# Altium schematic sheet HHO.SCHDOC
size B
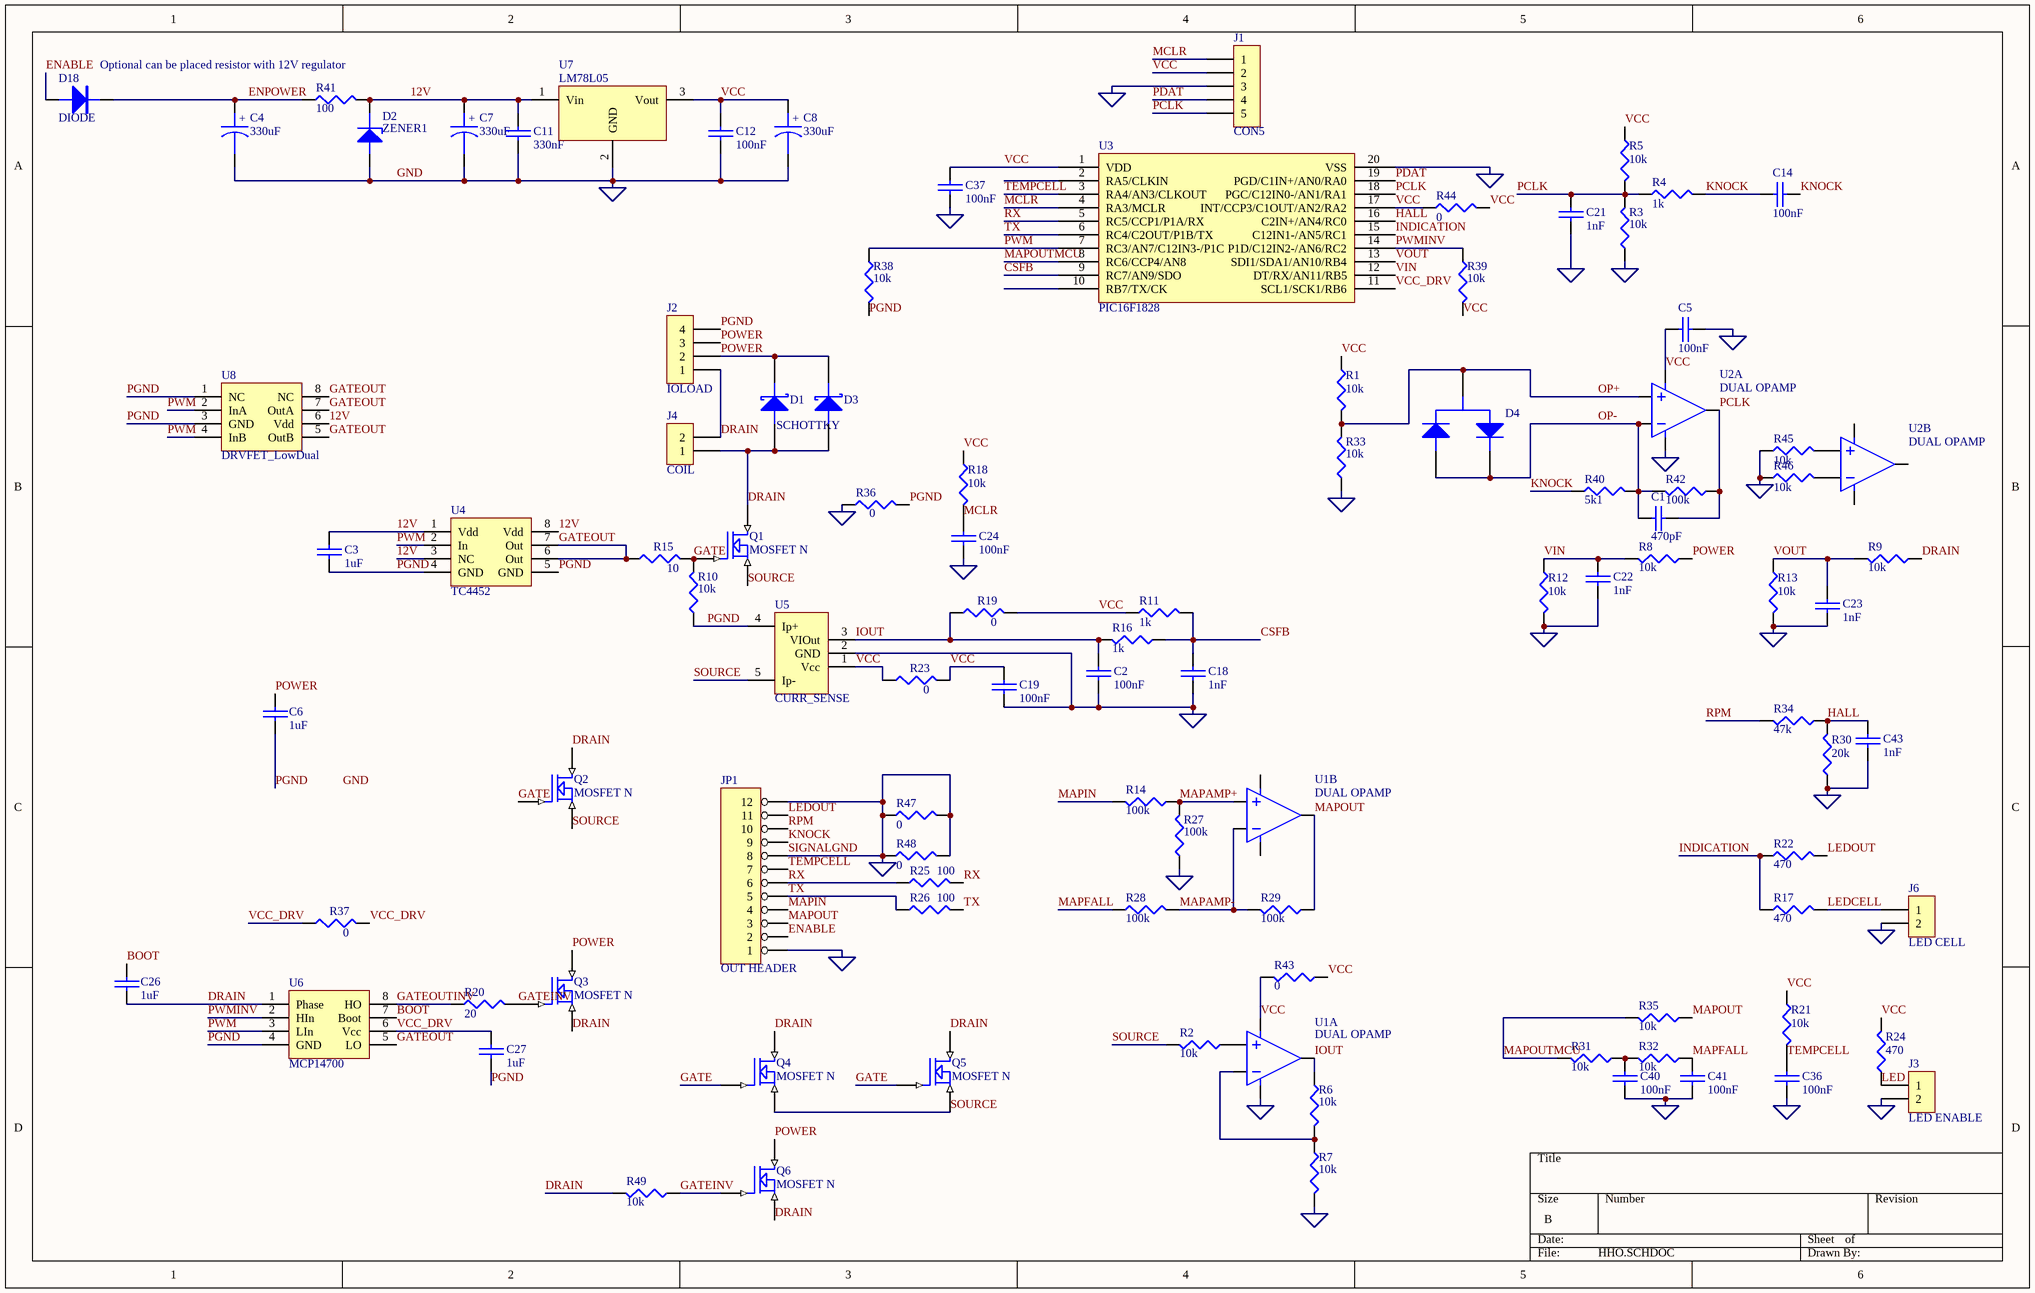
[diagram p0: HHO.SCHDOC]

## Parts
C1  470pF  [0603 CAP]
C2  100nF  [0603 CAP]
C3  1uF  [0805]
C4  330uF  [RA 6.3MM]
C5  100nF  [0603 CAP]
C6  1uF  [1210]
C7  330uF  [3528 + RA 6.3mm NOT ROUND]
C8  330uF  [3528 + RA 6.3mm NOT ROUND]
C11  330nF  [0805]
C12  100nF  [0805]
C14  100nF  [0603 CAP]
C18  1nF  [0603 CAP]
C19  100nF  [0603 CAP]
C21  1nF  [0603 CAP]
C22  1nF  [0603 CAP]
C23  1nF  [0603 CAP]
C24  100nF  [0603 CAP]
C26  1uF  [0805]
C27  1uF  [1005]
C36  100nF  [0603 CAP]
C37  100nF  [0603 CAP]
C40  100nF  [0603 CAP]
C41  100nF  [0603 CAP]
C43  1nF  [0603 CAP]
D1  SCHOTTKY  [D2-Pack - 3 - DIODE]
D2  ZENER1  [SIP2]
D3  (no value)  [D2-Pack - 3 - DIODE]
D4  DUAL DIODE BAV99  [SOT-23]  (value not drawn)
D18  DIODE  [SIP2]
J1  CON5  [SIP5]
J2  IOLOAD  [HD 11mm 4P HAMMOND]
J3  LED ENABLE  [SIP2]
J4  COIL  [SIP2 - INDUCTOR 20A]
J6  LED CELL  [SIP2]
JP1  OUT HEADER  [PWD12R]
Q1  MOSFET N  [D2-Pack - 7]
Q2  MOSFET N  [D2-Pack - 7]
Q3  MOSFET N  [D2-Pack - 7]
Q4  MOSFET N  [TO220]
Q5  MOSFET N  [TO220]
Q6  MOSFET N  [TO220]
R1  10k  [1005]
R2  10k  [0603 RES]
R3  10k  [0603 RES]
R4  1k  [0603 RES]
R5  10k  [0603 RES]
R6  10k  [0603 RES]
R7  10k  [0603 RES]
R8  10k  [0603 RES]
R9  10k  [1005]
R10  10k  [0603 RES]
R11  1k  [0603 RES]
R12  10k  [0603 RES]
R13  10k  [0603]
R14  100k  [0603 RES]
R15  10  [0603 RES]
R16  1k  [0603 RES]
R17  470  [0603 RES]
R18  10k  [0603 RES]
R19  0  [0603 RES]
R20  20  [0603 RES]
R21  10k  [0603 RES]
R22  470  [0603 RES]
R23  0  [0603 RES]
R24  470  [0603 RES]
R25  100  [0603 RES]
R26  100  [0603 RES]
R27  100k  [0603 RES]
R28  100k  [0603 RES]
R29  100k  [0603 RES]
R30  20k  [0603 RES]
R31  10k  [0603 RES]
R32  10k  [0603 RES]
R33  10k  [0603 RES]
R34  47k  [0603 RES]
R35  10k  [0603 RES]
R36  0  [0805]
R37  0  [0603 RES]
R38  10k  [0603 RES]
R39  10k  [0603 RES]
R40  5k1  [0603 RES]
R41  100  [0805]
R42  100k  [0603 RES]
R43  0  [0603 RES]
R44  0  [0603 RES]
R45  10k  [0603 RES]
R46  10k  [0603 RES]
R47  0  [0603 RES]
R48  0  [0603 RES]
R49  10k  [0603 RES]
U1  DUAL OPAMP  [SO-8]  (parts A,B of 2)
U2  DUAL OPAMP  [SO-8]  (parts A,B of 2)
U3  PIC16F1828  [SOIC20WIDE]
U4  TC4452  [SO-8]
U5  CURR_SENSE  [5-CB WIDE]
U6  MCP14700  [SO-8]
U7  LM78L05  [TO-92 WIDE]
U8  DRVFET_LowDual  [SO-8]

## Nets
GND: C2.2 C4.2 C5.1 C7.2 C8.2 C11.2 C12.2 C18.2 C19.2 C21.2 C22.2 C23.2 C24.2 C36.2 C37.2 C40.2 C41.2 C43.2 D2.1(A) J1.3 J3.2 J6.2 JP1.1 JP1.8 JP1.12 R3.1 R7.2 R12.2 R13.2 R27.1 R30.1 R33.1 R36.1 R45.1 R46.1 R47.1 R47.2 R48.1 R48.2 U1.4(V-) U2.4(V-) U3.20(VSS) U5.2(GND) U7.2(GND)  [also labelled SGND, SIGNALGND]
12V: C3.1 C7.1 C11.1 D2.2(K) R41.2 U4.1(Vdd) U4.3(NC) U4.8(Vdd) U7.1(Vin) U8.6(Vdd)
BOOT: C26.1 U6.7(Boot)
CSFB: C18.1 R11.2 R16.1 U3.9(RC7/AN9/SDO)
DRAIN: C26.2 D1.1(A) D3.1(A) J2.1 J4.1 J4.2 Q1.2(D) Q2.2(D) Q3.3(S) Q4.2(D) Q5.2(D) Q6.3(S) R9.1 R49.2 U6.1(Phase)
ENABLE: D18.1(A) JP1.2
ENPOWER: C4.1 D18.2(K) R41.1
GATE: Q1.1(G) Q2.1(G) Q4.1(G) Q5.1(G) R10.2 R15.2
GATEINV: Q3.1(G) Q6.1(G) R20.2 R49.1
GATEOUT: R15.1 U4.6(Out) U4.7(Out) U6.5(LO) U8.5(OutB) U8.7(OutA) U8.8(NC)
GATEOUTINV: R20.1 U6.8(HO)
HALL: C43.1 R30.2 R34.1 U3.16(C2IN+/AN4/RC0)
INDICATION: R17.1 R22.1 U3.15(C12IN1-/AN5/RC1)
IOUT: C2.1 R6.1 R16.2 R19.1 U1.1(OUT) U5.3(VIOut)
KNOCK: C14.1 C14.2 JP1.9 R4.2 R40.1
LED: J3.1 R24.1
LEDCELL: J6.1 R17.2
LEDOUT: JP1.11 R22.2
MAPAMP+: R14.1 R27.2 U1.5(IN+)
MAPAMP-: R28.2 R29.2 U1.6(IN-)
MAPFALL: C41.1 R28.1 R32.1
MAPIN: JP1.4 R14.2
MAPOUT: JP1.3 R29.1 R35.1 U1.7(OUT)
MAPOUTMCU: R31.2 R35.2 U3.8(RC6/CCP4/AN8)
MCLR: C24.1 J1.1 R18.2 U3.4(RA3/MCLR)
OP+: D4.2(AK) R1.2 R33.2 U2.3(IN+)
OP-: C1.1 D4.1(A) D4.3(K) R40.2 R42.2 U2.2(IN-)
PCLK: C1.2 C21.1 J1.5 R3.2 R4.1 R5.2 R42.1 U2.1(OUT) U3.18(PGC/C12IN0-/AN1/RA1)
PDAT: J1.4 U3.19(PGD/C1IN+/AN0/RA0)
PGND: C3.2 C6.2 C27.2 J2.4 R10.1 R36.2 R38.2 U4.4(GND) U4.5(GND) U5.4(Ip+) U6.4(GND) U8.1(NC) U8.3(GND)
POWER: C6.1 D1.2(K) D3.2(K) J2.2 J2.3 Q3.2(D) Q6.2(D) R8.1
PWM: R38.1 U3.7(RC3/AN7/C12IN3-/P1C) U4.2(In) U6.3(LIn) U8.2(InA) U8.4(InB)
PWMINV: R39.1 U3.14(P1D/C12IN2-/AN6/RC2) U6.2(HIn)
RPM: JP1.10 R34.2
RX: JP1.6 R25.1 R25.2 U3.5(RC5/CCP1/P1A/RX)
SOURCE: Q1.3(S) Q2.3(S) Q4.3(S) Q5.3(S) R2.2 U5.5(Ip-)
TEMPCELL: C36.1 JP1.7 R21.2 U3.3(RA4/AN3/CLKOUT)
TX: JP1.5 R26.1 R26.2 U3.6(RC4/C2OUT/P1B/TX)
VCC: C5.2 C8.1 C12.1 C19.1 C37.1 J1.2 R1.1 R5.1 R11.1 R18.1 R19.2 R21.1 R23.1 R23.2 R24.2 R39.2 R43.1 R43.2 R44.1 R44.2 U1.8(V+) U2.8(V+) U3.1(VDD) U3.17(INT/CCP3/C1OUT/AN2/RA2) U5.1(Vcc) U7.3(Vout)
VCC_DRV: C27.1 R37.1 R37.2 U3.11(SCL1/SCK1/RB6) U6.6(Vcc)
VIN: C22.1 R8.2 R12.1 U3.12(DT/RX/AN11/RB5)
VOUT: C23.1 R9.2 R13.1 U3.13(SDI1/SDA1/AN10/RB4)
NetC40_1: C40.1 R31.1 R32.2
NetR2_1: R2.1 U1.3(IN+)
NetR6_2: R6.2 R7.1 U1.2(IN-)
NetR45_2: R45.2 U2.5(IN+)
NetR46_2: R46.2 U2.6(IN-)

Not connected (* = marked no-connect by the designer): U2 7(OUT); U3 2(RA5/CLKIN) 10(RB7/TX/CK)

## Notes on the sheet
- Optional can be placed resistor with 12V regulator
- Labels drawn without touching a wire or pin: GND
- (in symbol CAPACITOR POL) +

## Library data of the parts
C1-C3 C5 C6 C11 C12 C14 C18 C19 C21-C24 C26 C27 C36 C37 C40 C41 C43 = CAP: Capacitor
C4 C7 C8 = CAPACITOR POL: Capacitor
D1 D3 = DIODE SCHOTTKY: Schottky Diode
D2 = ZENER1: Zener Diode
J1 = CON5: Connector
J2 = CON4: Connector
J3 J4 J6 = CON2: Connector
JP1 = 12 HEADER: 12 Pin Header
R1-R49 = RES1
U3 = PIC16F1828: Microchip Microcontroller
U4 = DRVFET_LowSingle: Mosfet Low Side Single driver
U5 = CURR_SENSE: Current Sense Hall
U6 = DRVFET_14700: Mosfet High and Low Side driver
U7 = VOLTREG
U8 = DRVFET_LowDual: Mosfet Low Side Dual driver